# EAGLE design Telemetria (EAGLE 9.6.2)
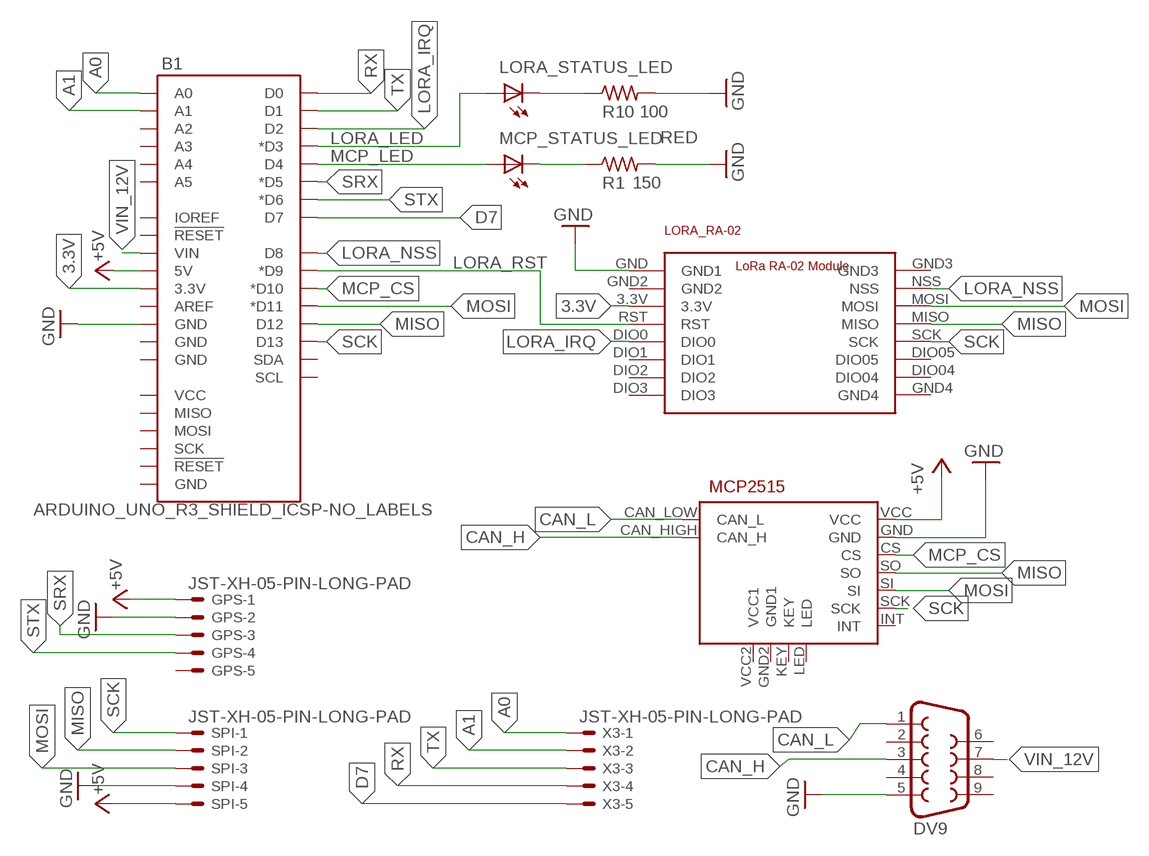
[diagram p0: schematic, sheet 1]

## Parts
B1  ARDUINO_UNO_R3_SHIELD_ICSP-NO_LABELS  [UNO_R3_SHIELD_ICSP_NOLABELS]
GPS  JST-XH-05-PIN-LONG-PAD  [JST-XH-05-PACKAGE-LONG-PAD]
LORA_RA-02  LORA_RA-02_MODULE  [LORA_RA-02_MODULE_FOOTPRINT]
LORA_STATUS_LED  BLUE  LEDCHIP-LED0805  [CHIP-LED0805]
MCP2515  MCP2515  [MCP2515]
MCP_STATUS_LED  RED  LEDCHIP-LED0805  [CHIP-LED0805]
R1  150  R-US_M0805  [M0805]
R10  100  R-US_M0805  [M0805]
SPI  JST-XH-05-PIN-LONG-PAD  [JST-XH-05-PACKAGE-LONG-PAD]
X3  JST-XH-05-PIN-LONG-PAD  [JST-XH-05-PACKAGE-LONG-PAD]
X4  DV9  F09H  [F09H]

## Nets
3.3V: B1.3.3V LORA_RA-02.3.3V
+5V: B1.5V GPS.1 MCP2515.VCC SPI.5
A0: B1.A0 X3.1
A1: B1.A1 X3.2
CAN_H: MCP2515.CAN_HIGH(CAN_H) X4.3
CAN_L: MCP2515.CAN_LOW(CAN_L) X4.1
D7: B1.D7 X3.5
GND: B1.GND@2(GND) GPS.2 LORA_RA-02.GND(GND1) MCP2515.GND R1.2 R10.2 SPI.4 X4.5
LORA_IRQ: B1.D2 LORA_RA-02.DIO0
LORA_LED: B1.D3(*D3) LORA_STATUS_LED.A
LORA_NSS: B1.D8 LORA_RA-02.NSS
LORA_RST: B1.D9(*D9) LORA_RA-02.RST
MCP_CS: B1.D10(*D10) MCP2515.CS
MCP_LED: B1.D4 MCP_STATUS_LED.A
MISO: B1.D12 LORA_RA-02.MISO MCP2515.SO SPI.2
MOSI: B1.D11(*D11) LORA_RA-02.MOSI MCP2515.SI SPI.3
N$5: LORA_STATUS_LED.C R10.1
N$7: MCP_STATUS_LED.C R1.1
RX: B1.RX(D0) X3.4
SCK: B1.D13 LORA_RA-02.SCK MCP2515.SCK SPI.1
SRX: B1.D5(*D5) GPS.3
STX: B1.D6(*D6) GPS.4
TX: B1.TX(D1) X3.3
VIN_12V: B1.VIN X4.7
Unconnected: B1.5V_ICSP(VCC) B1.A2 B1.A3 B1.A4 B1.A5 B1.AREF B1.GND@0(GND) B1.GND@1(GND) B1.GND_ICSP(GND) B1.IOREF B1.MISO B1.MOSI B1.RES(!RESET!) B1.RST_ICSP(!RESET!) B1.SCK B1.SCL B1.SDA GPS.5 LORA_RA-02.DIO1 LORA_RA-02.DIO2 LORA_RA-02.DIO3 LORA_RA-02.DIO04 LORA_RA-02.DIO05 LORA_RA-02.GND2 LORA_RA-02.GND3 LORA_RA-02.GND4 MCP2515.GND2(GND1) MCP2515.INT MCP2515.KEY MCP2515.LED MCP2515.VCC2(VCC1) X4.2 X4.4 X4.6 X4.8 X4.9

## Library data of the parts
B1 = SparkFun-Boards:ARDUINO_UNO_R3_SHIELD_ICSP: Arduino R3 Shield Footprint with ICSP Header Includes pins for 6-pin (2x3) ICSP Header. Compatible with Leonardo boards that require SPI pin connections via this header. SparkFun Products: CryptoShield <https://www.sparkfun.com/products/13183> microSD Shield <https://www.sparkfun.com/products/12761> R3 Stackable Headers Kit <https://www.sparkfun.com/products/1417>
GPS SPI X3 = Rembrandt Electronics - JST XH Connectors v1-0:JST-XH-05-PIN: JST XH Connector 2 Pin Wire to board connector. Pitch: 2,54 mm, (0.100") Number of pins: 5 Created by Rembrandt Electronics www.rembrandtelectronics.com
LORA_RA-02 = LORA_RA-02_MODULE:LORA_RA-02_MODULE: LoRa Ra-02 module for pin socket.
LORA_STATUS_LED MCP_STATUS_LED = led:LED: LED OSRAM: - CHIPLED LG R971, LG N971, LY N971, LG Q971, LY Q971, LO R971, LY R971 LH N974, LH R974 LS Q976, LO Q976, LY Q976 LO Q996 - Hyper CHIPLED LW Q18S LB Q993, LB Q99A, LB R99A - SideLED LS A670, LO A670, LY A670, LG A670, LP A670 LB A673, LV A673, LT A673, LW A673 LH A674 LY A675 LS A676, LA A676, LO A676, LY A676, LW A676 LS A679, LY A679, LG A679 - Hyper Micro SIDELED® LS Y876, LA Y876, LO Y876, LY Y876 LT Y87S - SmartLED LW L88C, LW L88S LB L89C, LB L89S, LG L890 LS L89K, LO L89K, LY L89K LS L896, LA L896, LO L896, LY L896 - TOPLED LS T670, LO T670, LY T670, LG T670, LP T670 LSG T670, LSP T670, LSY T670, LOP T670, LYG T670 LG T671, LOG T671, LSG T671 LB T673, LV T673, LT T673, LW T673 LH T674 LS T676, LA T676, LO T676, LY T676, LB T676, LH T676, LSB T676, LW T676 LB T67C, LV T67C, LT T67C, LS T67K, LO T67K, LY T67K, LW E67C LS E67B, LA E67B, LO E67B, LY E67B, LB E67C, LV E67C, LT E67C LW T67C LS T679, LY T679, LG T679 LS T770, LO T770, LY T770, LG T770, LP T770 LB T773, LV T773, LT T773, LW T773 LH T774 LS E675, LA E675, LY E675, LS T675 LS T776, LA T776, LO T776, LY T776, LB T776 LHGB T686 LT T68C, LB T68C - Hyper Mini TOPLED® LB M676 - Mini TOPLED Santana® LG M470 LS M47K, LO M47K, LY M47K Source: http://www.osram.convergy.de LUXEON: - LUMILED® LXK2-PW12-R00, LXK2-PW12-S00, LXK2-PW14-U00, LXK2-PW14-V00 LXK2-PM12-R00, LXK2-PM12-S00, LXK2-PM14-U00 LXK2-PE12-Q00, LXK2-PE12-R00, LXK2-PE12-S00, LXK2-PE14-T00, LXK2-PE14-U00 LXK2-PB12-K00, LXK2-PB12-L00, LXK2-PB12-M00, LXK2-PB14-N00, LXK2-PB14-P00, LXK2-PB14-Q00 LXK2-PR12-L00, LXK2-PR12-M00, LXK2-PR14-Q00, LXK2-PR14-R00 LXK2-PD12-Q00, LXK2-PD12-R00, LXK2-PD12-S00 LXK2-PH12-R00, LXK2-PH12-S00 LXK2-PL12-P00, LXK2-PL12-Q00, LXK2-PL12-R00 Source: www.luxeon.com KINGBRIGHT: KA-3528ASYC Source: www.kingbright.com
MCP2515 = EL_POTENCIA_LIBRERIA_VES2018:MCP2515
R1 R10 = resistor:R-US_: RESISTOR, American symbol
X4 = con-subd:F09: SUB-D; OC_FARNELL: unknown; OC_NEWARK: unknown

## Net classes
0 default: width 0.813 mm

## Board
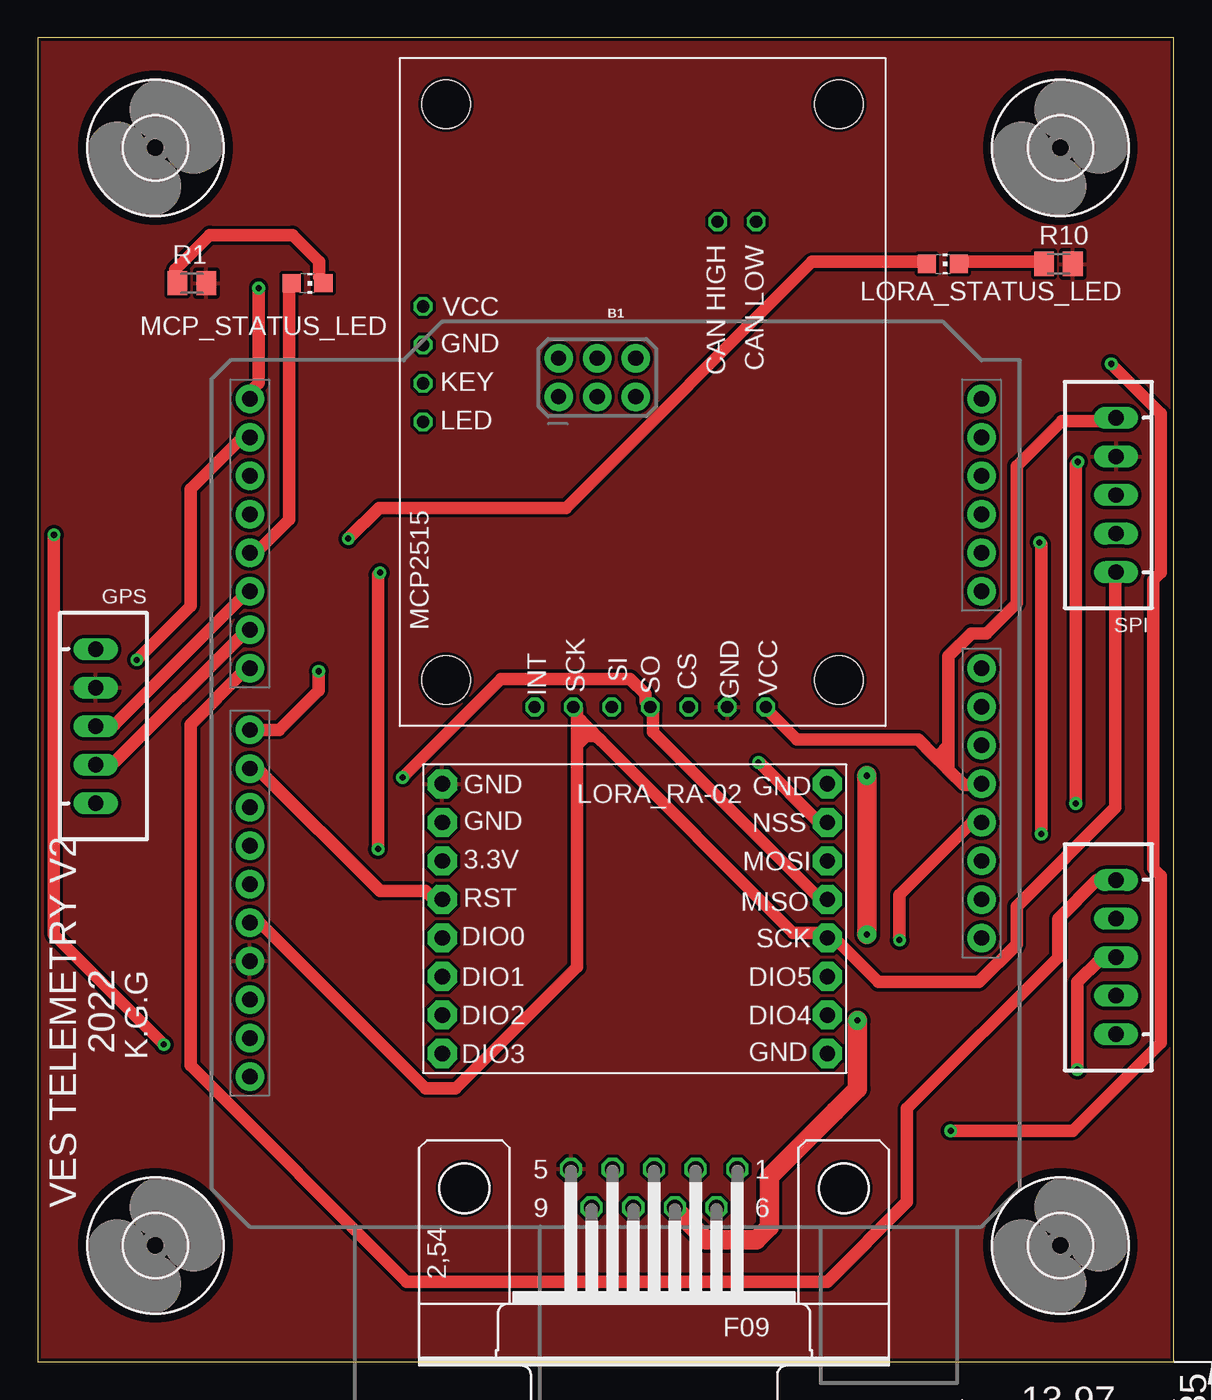
[diagram p1: board, top side]
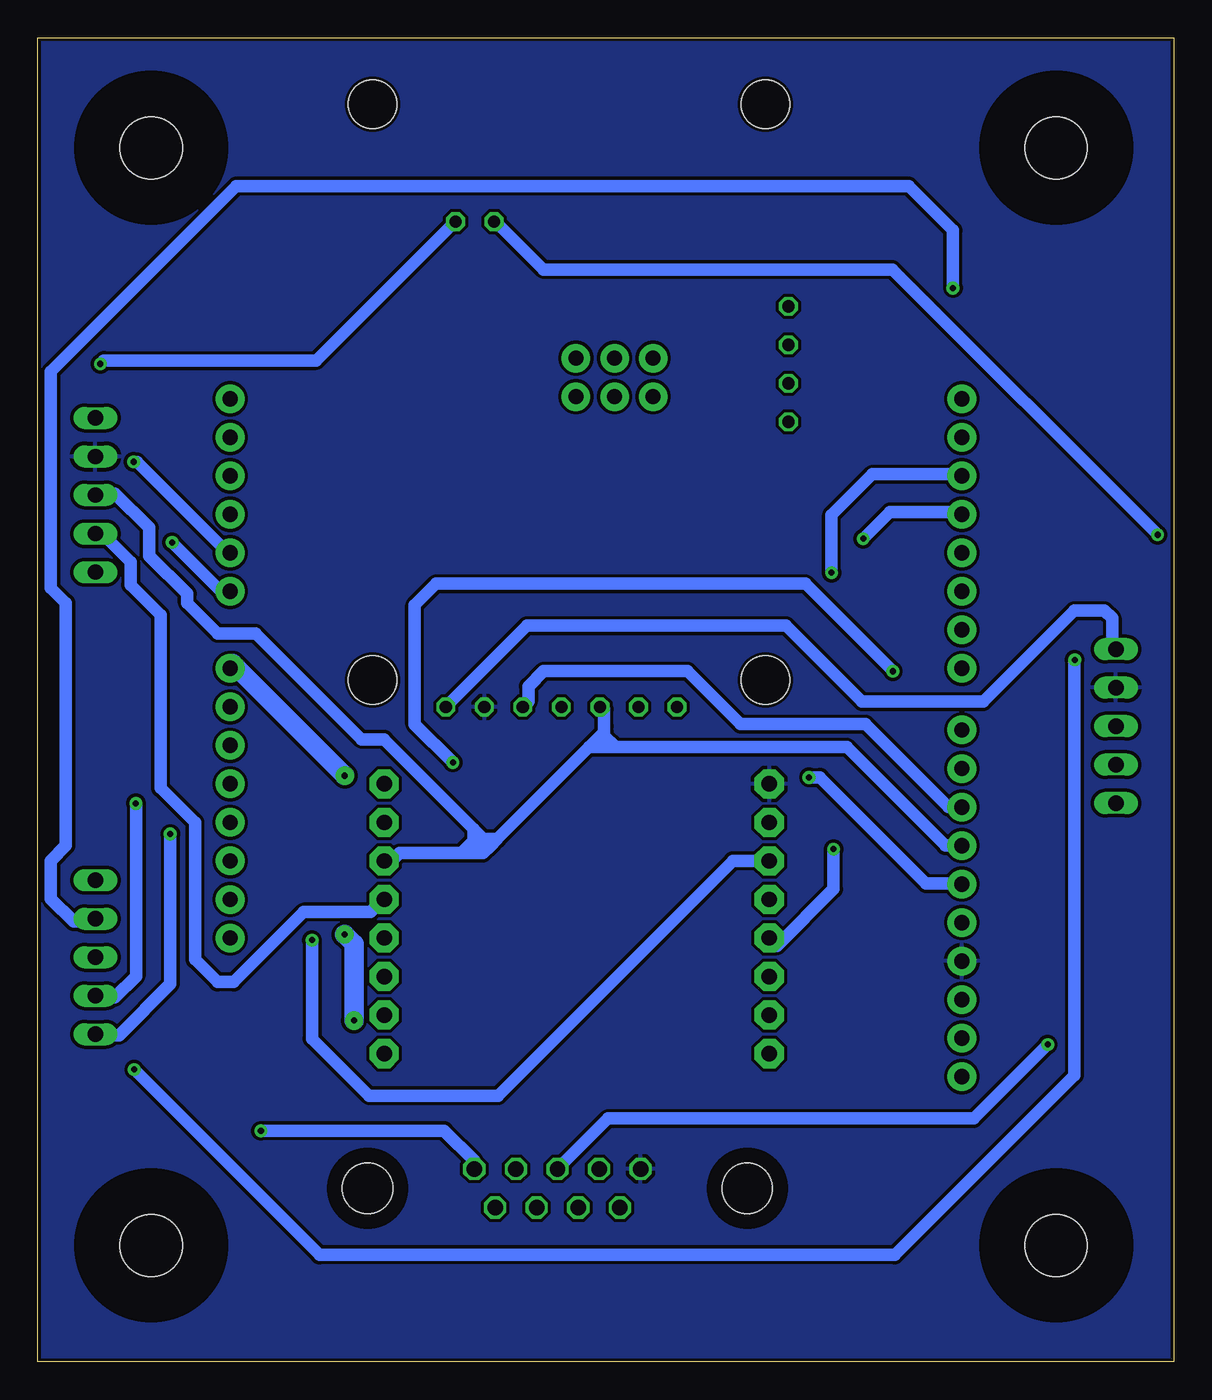
[diagram p2: board, bottom side, seen from below]

Size 74.91 x 87.3 mm. Coordinates in mm from the lower left corner, seen from the top.
Outline: 0,0 74.91,0 74.91,87.3 0,87.3 0,0
Copper layers (1*16): Top 0.035mm / dielectric 1.5mm / Bottom 0.035mm
Design rules "DRC_Colcircuitos *": minimum track width 32mil, minimum drill 0.4mm, track to track 0.22mm, track to pad 0.22mm, pad to pad 0.22mm, via to via 0.22mm, smd to smd 0mil, copper to edge 0.22mm, drill to drill 0.6mm, minimum pad ring 0.22mm, minimum via ring 0.22mm, stop-mask expansion 0.05mm, vias tented up to drill 0mil, thermal gap 10mil

### Footprints (pad centres in the part's own frame; a part is rotated, then mirrored left to right if it is on the bottom)
UNO_R3_SHIELD_ICSP_NOLABELS = drill 1.016 pad 1.88: 3.3V 24.13,-3.81; 5V 24.13,-1.27; 5V_ICSP -3.76,26.81; A0 24.13,11.43; A1 24.13,13.97; A2 24.13,16.51; A3 24.13,19.05; A4 24.13,21.59; A5 24.13,24.13; AREF -24.13,-15.494; D2 -24.13,19.05; D3 -24.13,16.51; D4 -24.13,13.97; D5 -24.13,11.43; D6 -24.13,8.89; D7 -24.13,6.35; D8 -24.13,2.286; D9 -24.13,-0.254; D10 -24.13,-2.794; D11 -24.13,-5.334; D12 -24.13,-7.874; D13 -24.13,-10.414; GND@0 24.13,1.27; GND@1 24.13,3.81; GND@2 -24.13,-12.954; GND_ICSP 1.32,26.81; IOREF 24.13,-8.89; MISO -3.76,24.27; MOSI -1.22,26.81; NC 24.13,-11.43; RES 24.13,-6.35; RST_ICSP 1.32,24.27; RX -24.13,24.13; SCK -1.22,24.27; SCL -24.13,-20.574; SDA -24.13,-18.034; TX -24.13,21.59; VIN 24.13,6.35
JST-XH-05-PACKAGE-LONG-PAD = drill 1.016 long: 1 -5.08,0; 2 -2.54,0; 3 0,0; 4 2.54,0; 5 5.08,0
LORA_RA-02_MODULE_FOOTPRINT = drill 1.016 pad 1.93 octagon: 3.3V -12.7,3.81; DIO0 -12.7,-1.27; DIO1 -12.7,-3.81; DIO2 -12.7,-6.35; DIO3 -12.7,-8.89; DIO04 12.7,-6.35; DIO05 12.7,-3.81; GND -12.7,8.89; GND2 -12.7,6.35; GND3 12.7,8.89; GND4 12.7,-8.89; MISO 12.7,1.27; MOSI 12.7,3.81; NSS 12.7,6.35; RST -12.7,1.27; SCK 12.7,-1.27
CHIP-LED0805 = smd 1.2 x 1.2: A 0,-1.05; C 0,1.05
MCP2515 = drill 0.8 octagon: CAN_HIGH -9.144,5.461; CAN_LOW -9.144,8.001; CS 22.86,3.556; GND 22.86,6.096; GND2 -1.016,-13.97; INT 22.86,-6.604; KEY 1.524,-13.97; LED 4.064,-13.97; SCK 22.86,-4.064; SI 22.86,-1.524; SO 22.86,1.016; VCC 22.86,8.636; VCC2 -3.556,-13.97 | hole 3.2: 21.082,-12.446; 21.082,13.462; -16.891,-12.446; -16.891,13.462
M0805 = smd 1.3 x 1.6: 1 -0.95,0; 2 0.95,0
4,1 = hole 4.1: 0,0
F09H = drill 1.016 octagon: 1 -5.486,-1.27; 2 -2.743,-1.27; 3 0,-1.27; 4 2.743,-1.27; 5 5.486,-1.27; 6 -4.115,1.27; 7 -1.372,1.27; 8 1.372,1.27; 9 4.115,1.27 | hole 3.302: -12.522,0; 12.522,0

### Placement (x,y rotation side)
B1  38.1,39.37 0 top
GPS  3.81,41.91 270 top
LORA_RA-02  39.37,29.21 0 top
LORA_STATUS_LED  59.69,72.39 270 top
MCP2515  39.37,66.04 270 top
MCP_STATUS_LED  17.78,71.12 270 top
R1  10.16,71.12 0 top
R10  67.31,72.39 0 top
SPI  71.12,57.15 90 top
U$1  [4,1]  7.75,80.05 0 top
U$2  [4,1]  67.44,80.05 0 top
U$3  [4,1]  67.44,7.66 0 top
U$4  [4,1]  7.75,7.66 0 top
X3  71.12,26.67 90 top
X4  40.64,11.43 180 top

### Tracks (layer width: path | path; a pad name or v marks a point on that pad's centre or on a via)
3.3V  (via drill 0.4)
  Top 0.813: v56.83,27.8 v56.82,27.81 56.82,30.79 61.56,35.53 62.06,35.53 B1.3.3V
  Bottom 0.813: v56.83,27.8 56.83,21.3 53.06,17.53 44.56,17.53 29.07,33.02 26.65,33.02 LORA_RA-02.3.3V
+5V
  Top 0.813: 60.06,39.03 61.06,38.03 62.06,38.03 B1.5V | 60.06,39.03 59.81,39.28 | 59.81,39.28 59.07,40.02 | 59.07,40.02 58.06,41.03 50.06,41.03 48.06,43.03 MCP2515.VCC | 60.06,40.64 60.06,39.53 | 60.06,40.64 60.06,46.53 61.56,48.03 62.56,48.03 64.56,50.03 64.56,59.07 67.52,62.03 71.06,62.03 SPI.5 | 60.06,39.53 59.81,39.28 | 60.06,39.53 60.06,39.03 | 60.06,40.64 59.44,40.02 59.07,40.02
  Bottom 0.813: GPS.1 4.06,47.03 4.06,49.03 4.56,49.53 6.56,49.53 12.56,43.53 20.56,43.53 25.56,48.53 42.66,48.53 MCP2515.VCC
A0  (via drill 0.4)
  Top 0.813: v66.18,34.8 v66.19,34.8 66.19,53.9 v66.06,54.03
  Bottom 0.813: v66.18,34.8 66.18,24.91 69.56,21.53 71.06,21.53 X3.1 | v66.06,54.03 62.56,50.53 B1.A0
A1  (via drill 0.4)
  Top 0.813: v68.45,36.82 68.45,59.19 v68.6,59.34
  Bottom 0.813: v68.45,36.82 68.44,36.81 68.44,25.42 69.83,24.03 71.06,24.03 X3.2 | v68.6,59.34 68.37,59.34 62.56,53.53 B1.A1
CAN_H  (via drill 0.4)
  Top 0.813: v1.06,54.53 1.06,28.16 v8.31,20.91
  Bottom 0.813: v1.06,54.53 18.56,72.03 41.56,72.03 44.56,75.03 MCP2515.CAN_HIGH | v8.31,20.91 13.19,16.03 37.3,16.03 40.63,12.7 X4.3
CAN_L  (via drill 0.4)
  Top 0.813: v70.79,65.8 74.06,62.53 74.06,52.03 73.56,51.53 73.56,32.53 74.06,32.03 74.06,21.03 68.25,15.22 v60.2,15.22
  Bottom 0.813: v70.79,65.8 70.56,66.03 56.56,66.03 47.56,75.03 MCP2515.CAN_LOW | v60.2,15.22 48.11,15.22 46.13,13.24 X4.1
D7
  Top 0.813: B1.D7 13.56,45.53 10.06,42.03 10.06,19.53 24.33,5.26 52.06,5.26 57.33,10.53 57.33,16.69 67.31,26.67 67.31,29.21 69.85,31.75 X3.5
GND
  pour Top: 0,0 74.93,0 74.93,87.25 0,87.25
  pour Bottom: 0,87.63 74.93,87.63 74.93,0 0,0
  pour Bottom (isolate 0.5): 0,87.63 74.93,87.63 74.93,0 0,0
LORA_IRQ  (via drill 0.4)
  Top 0.813: v22.56,52.03 22.43,51.9 v22.43,33.8
  Bottom 0.813: v22.56,52.03 22.56,55.84 19.87,58.53 14.06,58.53 B1.D2 | v22.43,33.8 22.43,31.16 26.16,27.43 LORA_RA-02.DIO0
LORA_LED  (via drill 0.4)
  Top 0.813: v20.47,54.27 22.51,56.3 34.83,56.3 51.06,72.53 58.56,72.53 LORA_STATUS_LED.A
  Bottom 0.813: v20.47,54.27 18.71,56.03 14.06,56.03 B1.D3
LORA_NSS  (via drill 0.4)
  Top 0.813: v18.52,45.53 18.52,44.26 15.92,41.66 B1.D8 | v47.54,39.51 47.58,39.51 51.56,35.53 52.06,35.53 LORA_RA-02.NSS
  Bottom 0.813: v18.52,45.53 24.29,51.3 48.64,51.3 50.05,49.89 50.05,42.03 v47.54,39.51
LORA_RST
  Top 0.813: B1.D9 14.06,39.03 14.56,39.03 22.56,31.03 25.56,31.03 26.56,30.03 LORA_RA-02.RST
MCP_CS
  Bottom 0.813: MCP2515.CS 42.56,43.53 42.56,44.53 41.56,45.53 32.06,45.53 28.57,42.04 20.32,42.04 14.86,36.58 B1.D10
MCP_LED
  Top 0.813: MCP_STATUS_LED.A 16.56,71.03 16.56,55.53 14.06,53.03 B1.D4
MISO  (via drill 0.4)
  Top 0.813: LORA_RA-02.MISO 52.06,30.03 40.56,41.53 40.56,43.03 MCP2515.SO 40.06,43.53 40.06,44.03 39.06,45.03 30.56,45.03 v24.06,38.53
  Bottom 0.813: SPI.2 70.66,54.61 68.79,52.75 68.79,51.22 66.81,49.24 66.81,37.82 64.55,35.56 64.55,26.52 63.06,25.03 61.99,25.03 57.37,29.65 52.98,29.65 LORA_RA-02.MISO | v24.06,38.53 23.33,38.53 16.33,31.53 14.06,31.53 B1.D12
MOSI
  Bottom 0.813: 37.56,41.53 37.56,41.91 37.56,43.03 MCP2515.SI | 45.07,34.02 45.56,33.53 45.72,33.53 | 45.07,34.02 44.62,34.47 | 44.62,34.47 38.56,40.53 | 38.56,40.53 37.56,41.53 | 46.99,33.53 51.06,33.53 52.06,32.53 LORA_RA-02.MOSI | 46.99,33.53 45.72,33.53 | 45.07,34.02 45.51,34.47 | 46.16,35.12 52.08,41.03 53.56,41.03 60.56,48.03 63.06,48.03 65.06,50.03 65.06,50.64 67.56,53.14 67.56,54.99 69.83,57.26 70.06,57.03 71.06,57.03 SPI.3 | 38.56,40.53 36.83,40.53 | 36.83,40.53 21.56,40.53 15.06,34.03 14.06,34.03 B1.D11 | 44.62,34.47 45.51,34.47 | 46.16,35.12 45.51,34.47 | 46.16,35.12 46.16,34.36 | 46.16,34.36 46.99,33.53 | 45.51,34.47 46.05,34.47 46.16,34.36 | 45.51,34.47 45.72,34.26 45.72,33.53 | 37.56,41.53 37.56,41.26 36.83,40.53
N$5
  Top 0.813: LORA_STATUS_LED.C 61.06,72.53 66.06,72.53 R10.1
N$7
  Top 0.813: MCP_STATUS_LED.C 18.56,71.53 18.56,72.53 16.79,74.3 11.33,74.3 9.06,72.03 9.06,71.53 R1.1
RX  (via drill 0.4)
  Top 0.813: v14.56,70.8 14.56,64.53 14.06,64.03 14.06,63.53 B1.RX
  Bottom 0.813: v14.56,70.8 14.56,74.61 17.48,77.53 61.83,77.53 74.06,65.3 74.06,51.03 73.06,50.03 73.06,34.03 74.06,33.03 74.06,30.53 72.56,29.03 71.56,29.03 X3.4
SCK
  Top 0.813: 36.82,41.27 36.51,41.59 | 36.51,41.59 35.81,42.28 | 35.81,42.28 35.56,42.53 35.56,43.03 MCP2515.SCK 35.56,42.93 35.56,42.03 | SPI.1 71.06,52.03 71.06,36.53 64.56,30.03 64.56,27.53 62.06,25.03 55.43,25.03 52.45,28.01 LORA_RA-02.SCK 52.06,27.53 51.31,28.28 49.81,28.28 37.14,40.95 36.82,41.27 | 35.56,40.64 35.56,26.03 27.56,18.03 25.56,18.03 14.56,29.03 14.06,29.03 B1.D13 | 35.56,40.64 35.56,42.03 | 35.56,42.03 35.81,42.28 | 35.56,40.64 36.2,41.27 | 36.2,41.27 36.51,41.59 | 36.2,41.27 36.82,41.27
SRX
  Top 0.813: GPS.3 4.06,42.03 5.06,42.03 13.56,50.53 B1.D5
STX
  Top 0.813: GPS.4 4.06,39.53 5.06,39.53 13.56,48.03 B1.D6
TX  (via drill 0.4)
  Top 0.813: v68.56,19.26 68.56,25.03 70.06,26.53 71.06,26.53 X3.3 | v6.53,46.28 10.06,49.82 10.06,57.53 13.56,61.03 B1.TX
  Bottom 0.813: v68.56,19.26 56.33,7.03 18.4,7.03 6.55,18.88 6.55,46.26 v6.53,46.28
VIN_12V  (via drill 0.4 pad 1.2)
  Top 0.813: v54.67,38.64 54.69,38.64 | 42.06,10.03 X4.7
  Top 1.27: 42.06,10.03 44.06,8.03 47.4,8.03 48.26,8.89 48.26,12.19 52.58,16.51 54.06,17.99 v54.06,22.49 | 54.69,38.64 v54.69,28.17
  Bottom 0.813: 62.06,46.03 B1.VIN
  Bottom 1.27: v54.06,22.49 54.06,27.54 v54.69,28.17 | 62.06,46.03 v54.67,38.64

### Text on the board
tPlace: 2022 | K.G.G | VES TELEMETRY V2